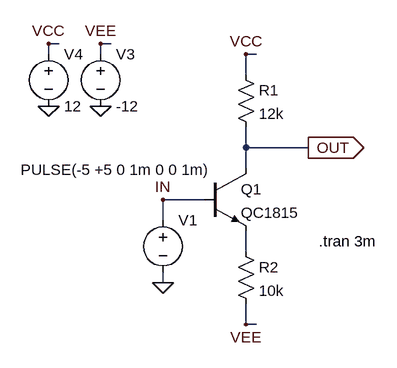
[diagram p0: schematic SAW_TRI_A2.asc]
SAW_TRI_A2.asc, the LTspice schematic file:
Version 4
SHEET 1 880 680
WIRE -48 -64 -64 -64
WIRE 32 -64 16 -64
WIRE -64 -48 -64 -64
WIRE 16 -48 16 -64
WIRE 256 -48 240 -48
WIRE 240 -16 240 -48
WIRE 240 96 240 64
WIRE 336 96 240 96
WIRE 240 128 240 96
WIRE 176 176 112 176
WIRE 112 208 112 176
WIRE 240 256 240 224
WIRE 112 304 112 288
WIRE 240 368 240 336
WIRE 256 368 240 368
FLAG 112 304 0
FLAG 112 176 IN
FLAG 240 -48 VCC
FLAG 240 368 VEE
FLAG 336 96 OUT
IOPIN 336 96 Out
FLAG 16 32 0
FLAG -64 32 0
FLAG 16 -64 VEE
FLAG -64 -64 VCC
SYMBOL npn 176 128 R0
SYMATTR InstName Q1
SYMATTR Value QC1815
SYMBOL voltage 112 192 R0
WINDOW 3 -219 -62 Left 2
WINDOW 123 0 0 Left 2
WINDOW 39 0 0 Left 2
SYMATTR Value PULSE(-5 +5 0 1m 0 0 1m)
SYMATTR InstName V1
SYMBOL res 224 -32 R0
SYMATTR InstName R1
SYMATTR Value 12k
SYMBOL res 224 240 R0
SYMATTR InstName R2
SYMATTR Value 10k
SYMBOL voltage 16 -64 R0
WINDOW 123 0 0 Left 2
WINDOW 39 0 0 Left 2
SYMATTR InstName V3
SYMATTR Value -12
SYMBOL voltage -64 -64 R0
WINDOW 123 0 0 Left 2
WINDOW 39 0 0 Left 2
SYMATTR InstName V4
SYMATTR Value 12
TEXT 352 240 Left 2 !.tran 3m

The netlist it stands for:
* SAW_TRI_A2.asc
Q1 OUT IN N001 0 QC1815
V1 IN 0 PULSE(-5 +5 0 1m 0 0 1m)
R1 VCC OUT 12k
R2 N001 VEE 10k
V3 VEE 0 -12
V4 VCC 0 12
.model NPN NPN
.model PNP PNP
.lib standard.bjt
.tran 3m
.backanno
.end